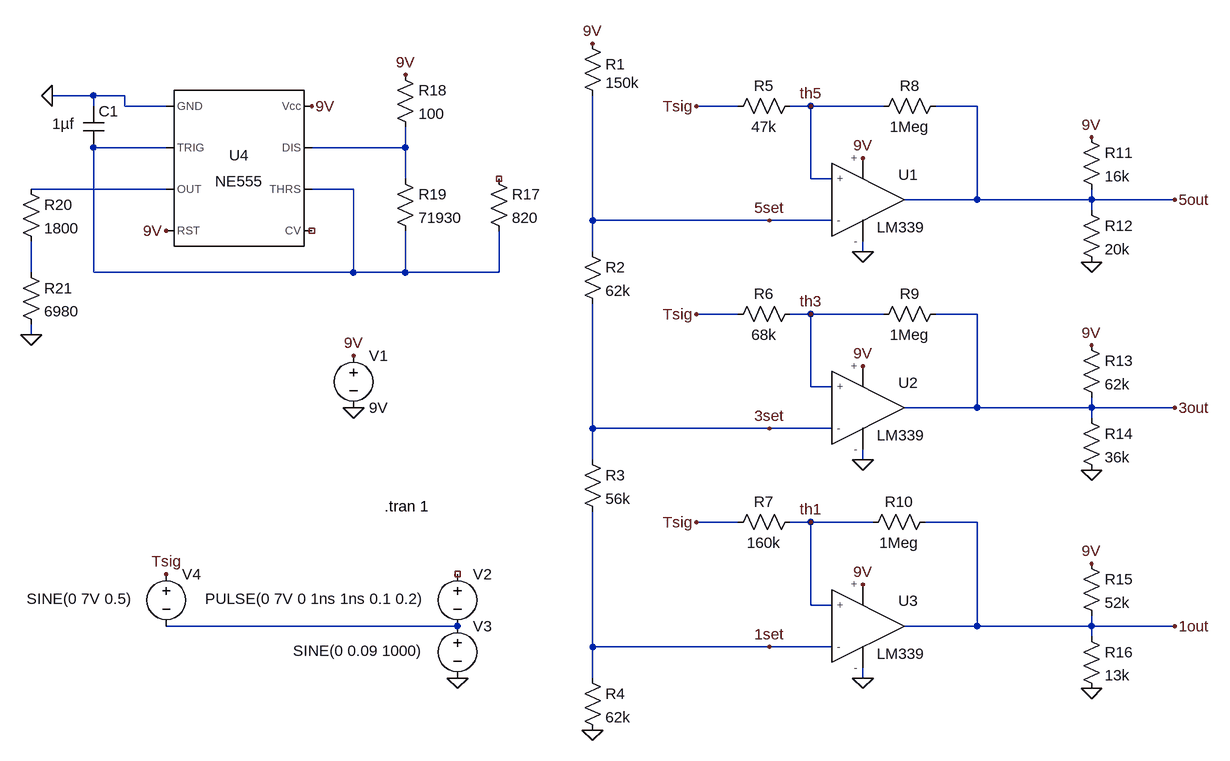
[diagram p0: schematic hysteresis.asc]
hysteresis.asc, the LTspice schematic file:
Version 4
SHEET 1 880 1064
WIRE -1008 0 -1072 0
WIRE -960 0 -1008 0
WIRE -1008 16 -1008 0
WIRE -960 16 -960 0
WIRE -896 16 -960 16
WIRE -16 16 -80 16
WIRE 96 16 64 16
WIRE 208 16 96 16
WIRE 352 16 288 16
WIRE -896 80 -1008 80
WIRE -528 80 -528 48
WIRE -528 80 -672 80
WIRE -528 128 -528 80
WIRE 96 128 96 16
WIRE 128 128 96 128
WIRE -896 144 -1104 144
WIRE -608 144 -672 144
WIRE 352 160 352 16
WIRE 352 160 240 160
WIRE 528 160 528 144
WIRE 528 160 352 160
WIRE 656 160 528 160
WIRE 528 176 528 160
WIRE -240 192 -240 0
WIRE 32 192 -240 192
WIRE 128 192 32 192
WIRE -240 240 -240 192
WIRE 176 240 176 224
WIRE -1104 272 -1104 224
WIRE -1008 272 -1008 80
WIRE -608 272 -608 144
WIRE -608 272 -1008 272
WIRE -528 272 -528 208
WIRE -528 272 -608 272
WIRE -384 272 -384 208
WIRE -384 272 -528 272
WIRE -16 336 -80 336
WIRE 96 336 64 336
WIRE 208 336 96 336
WIRE 352 336 288 336
WIRE -1104 368 -1104 352
WIRE 96 448 96 336
WIRE 128 448 96 448
WIRE 352 480 352 336
WIRE 352 480 240 480
WIRE 528 480 528 464
WIRE 528 480 352 480
WIRE 656 480 528 480
WIRE 528 496 528 480
WIRE -240 512 -240 320
WIRE 32 512 -240 512
WIRE 128 512 32 512
WIRE -240 560 -240 512
WIRE 176 560 176 544
WIRE -16 656 -80 656
WIRE 96 656 64 656
WIRE 192 656 96 656
WIRE 352 656 272 656
WIRE 96 784 96 656
WIRE 128 784 96 784
WIRE -448 816 -896 816
WIRE 352 816 352 656
WIRE 352 816 240 816
WIRE 528 816 528 800
WIRE 528 816 352 816
WIRE 656 816 528 816
WIRE 528 832 528 816
WIRE -240 848 -240 640
WIRE 32 848 -240 848
WIRE 128 848 32 848
WIRE -240 896 -240 848
WIRE 176 896 176 880
FLAG -608 480 0
FLAG -608 400 9V
FLAG 176 96 9V
FLAG 176 240 0
FLAG 176 416 9V
FLAG 176 560 0
FLAG 176 752 9V
FLAG 176 896 0
FLAG -448 896 0
FLAG 528 720 9V
FLAG 528 384 9V
FLAG 528 64 9V
FLAG -240 -80 9V
FLAG -240 976 0
FLAG 528 912 0
FLAG 528 576 0
FLAG 528 256 0
FLAG -80 16 Tsig
FLAG -80 336 Tsig
FLAG -80 656 Tsig
FLAG 656 160 5out
FLAG 656 480 3out
FLAG 656 816 1out
FLAG 32 192 5set
FLAG 32 512 3set
FLAG 32 848 1set
FLAG 96 16 th5
FLAG 96 336 th3
FLAG 96 656 th1
FLAG -528 -32 9V
FLAG -672 16 9V
FLAG -896 208 9V
FLAG -1072 0 0
FLAG -1104 368 0
FLAG -896 736 Tsig
DATAFLAG -144 512 ""
DATAFLAG -160 192 ""
DATAFLAG -176 848 ""
SYMBOL AutoGenerated\\LM339 160 160 R0
SYMATTR InstName U1
SYMBOL voltage -608 384 R0
WINDOW 123 0 0 Left 0
WINDOW 39 0 0 Left 0
SYMATTR InstName V1
SYMATTR Value 9V
SYMBOL res -256 -96 R0
WINDOW 0 36 48 Left 2
SYMATTR InstName R1
SYMATTR Value 150k
SYMBOL res -256 224 R0
SYMATTR InstName R2
SYMATTR Value 62k
SYMBOL res -256 544 R0
SYMATTR InstName R3
SYMATTR Value 56k
SYMBOL AutoGenerated\\LM339 160 480 R0
SYMATTR InstName U2
SYMBOL AutoGenerated\\LM339 160 816 R0
SYMATTR InstName U3
SYMBOL res -256 880 R0
SYMATTR InstName R4
SYMATTR Value 62k
SYMBOL res -32 32 R270
WINDOW 0 32 56 VTop 2
WINDOW 3 0 56 VBottom 2
SYMATTR InstName R5
SYMATTR Value 47k
SYMBOL res -32 352 R270
WINDOW 0 32 56 VTop 2
WINDOW 3 0 56 VBottom 2
SYMATTR InstName R6
SYMATTR Value 68k
SYMBOL res -32 672 R270
WINDOW 0 32 56 VTop 2
WINDOW 3 0 56 VBottom 2
SYMATTR InstName R7
SYMATTR Value 160k
SYMBOL res 192 32 R270
WINDOW 0 32 56 VTop 2
WINDOW 3 0 56 VBottom 2
SYMATTR InstName R8
SYMATTR Value 1Meg
SYMBOL res 192 352 R270
WINDOW 0 32 56 VTop 2
WINDOW 3 0 56 VBottom 2
SYMATTR InstName R9
SYMATTR Value 1Meg
SYMBOL res 176 672 R270
WINDOW 0 32 56 VTop 2
WINDOW 3 0 56 VBottom 2
SYMATTR InstName R10
SYMATTR Value 1Meg
SYMBOL res 512 48 R0
SYMATTR InstName R11
SYMATTR Value 16k
SYMBOL res 512 160 R0
SYMATTR InstName R12
SYMATTR Value 20k
SYMBOL res 512 368 R0
SYMATTR InstName R13
SYMATTR Value 62k
SYMBOL voltage -448 720 R0
WINDOW 3 -388 54 Left 2
WINDOW 123 0 0 Left 0
WINDOW 39 0 0 Left 0
SYMATTR Value PULSE(0 7V 0 1ns 1ns 0.1 0.2)
SYMATTR InstName V2
SYMBOL res 512 480 R0
SYMATTR InstName R14
SYMATTR Value 36k
SYMBOL res 512 704 R0
SYMATTR InstName R15
SYMATTR Value 52k
SYMBOL res 512 816 R0
SYMATTR InstName R16
SYMATTR Value 13k
SYMBOL voltage -896 720 R0
WINDOW 3 -215 54 Left 2
WINDOW 123 0 0 Left 0
WINDOW 39 0 0 Left 0
SYMATTR Value SINE(0 7V 0.5)
SYMATTR InstName V4
SYMBOL Misc\\NE555 -784 112 R0
SYMATTR InstName U4
SYMBOL res -544 112 R0
SYMATTR InstName R19
SYMATTR Value 71930
SYMBOL res -400 112 R0
SYMATTR InstName R17
SYMATTR Value 820
SYMBOL res -544 -48 R0
SYMATTR InstName R18
SYMATTR Value 100
SYMBOL cap -1024 16 R0
WINDOW 3 -48 27 Left 2
SYMATTR Value 1µf
SYMATTR InstName C1
SYMBOL res -1120 128 R0
SYMATTR InstName R20
SYMATTR Value 1800
SYMBOL res -1120 256 R0
SYMATTR InstName R21
SYMATTR Value 6980
SYMBOL voltage -448 800 R0
WINDOW 3 -253 54 Left 2
WINDOW 123 0 0 Left 0
WINDOW 39 0 0 Left 0
SYMATTR Value SINE(0 0.09 1000)
SYMATTR InstName V3
TEXT -560 632 Left 2 !.tran 1

The netlist it stands for:
* hysteresis.asc
XU1 th5 5set 9V 0 5out LM339  ; pins + - + - ?
V1 9V 0 9V
R1 9V 5set 150k
R2 5set 3set 62k
R3 3set 1set 56k
XU2 th3 3set 9V 0 3out LM339  ; pins + - + - ?
XU3 th1 1set 9V 0 1out LM339  ; pins + - + - ?
R4 1set 0 62k
R5 Tsig th5 47k
R6 Tsig th3 68k
R7 Tsig th1 160k
R8 th5 5out 1Meg
R9 th3 3out 1Meg
R10 th1 1out 1Meg
R11 9V 5out 16k
R12 5out 0 20k
R13 9V 3out 62k
V2 NC_01 N005 PULSE(0 7V 0 1ns 1ns 0.1 0.2)
R14 3out 0 36k
R15 9V 1out 52k
R16 1out 0 13k
V4 Tsig N005 SINE(0 7V 0.5)
XU4 0 N001 N003 9V NC_02 N001 N002 9V NE555  ; pins GND TRIG OUT RST CV THRS DIS Vcc
R19 N002 N001 71930
R17 NC_03 N001 820
R18 9V N002 100
C1 0 N001 1µf
R20 N003 N004 1800
R21 N004 0 6980
V3 N005 0 SINE(0 0.09 1000)
.tran 1
.lib C:\Users\walto\Desktop\School\2021-Spring\COMPE-496A\senior_design\mini_project\LM339.5_1
.lib NE555.sub
.backanno
.end